# EAGLE design WiFi_Board_R1_1_0 (EAGLE 6.6.0)
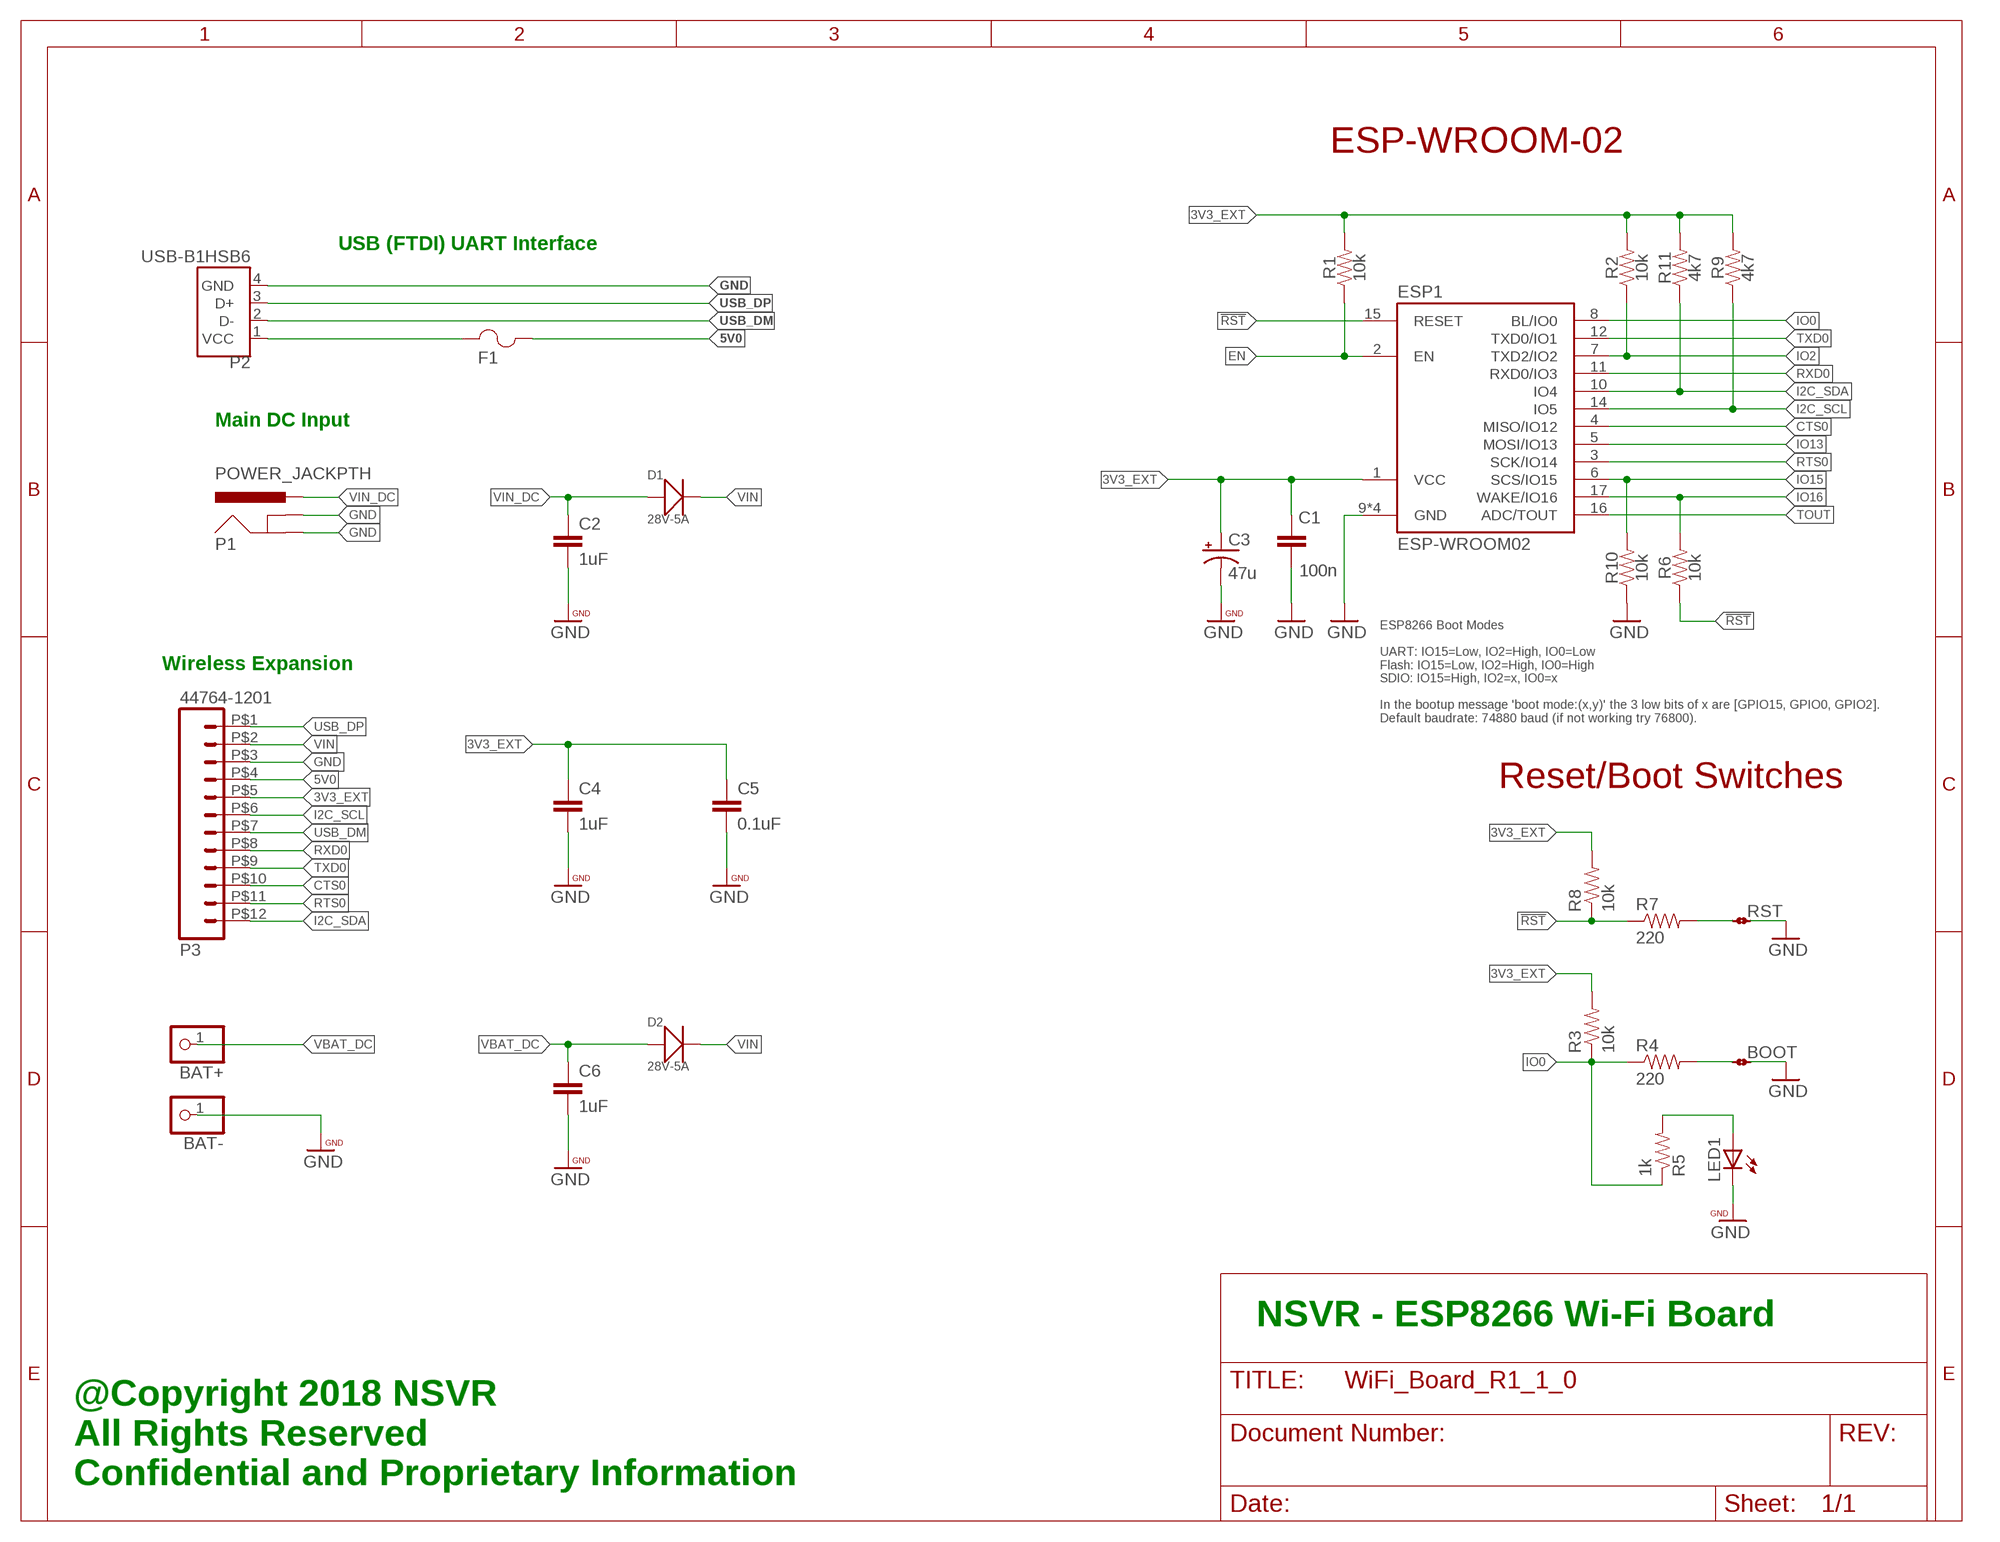
[diagram p0: schematic, sheet 1]

## Parts
BAT+  WPAD-1-PTH  [WPAD-1-PTH-2.54]
BAT-  WPAD-1-PTH  [WPAD-1-PTH-2.54]
BOOT  JMP-2-NO-PTH  [JMP-2-NO-PTH-2.54]
C1  100n  CAP0402-CAP  [0402-CAP]
C2  1uF  CAP0402-CAP  [0402-CAP]
C3  47u  CAP_POLD  [PANASONIC_D]
C4  1uF  CAP0402-CAP  [0402-CAP]
C5  0.1uF  CAP0402-CAP  [0402-CAP]
C6  1uF  CAP0402-CAP  [0402-CAP]
D1  28V-5A  SMD-DIODE-SCHOTTKY-28V-5A(DO-214AA)  [DO-214AA]
D2  28V-5A  SMD-DIODE-SCHOTTKY-28V-5A(DO-214AA)  [DO-214AA]
ESP1  ESP-WROOM02  [ESP-WROOM02]
F1  1206L050YR  [1206LSERIES]
LED1  LEDCHIP-LED0603  [CHIP-LED0603]
P1  POWER_JACKPTH  [POWER_JACK_PTH]
P2  USB-B1HSB6  [OST_USB-B1HSB6]
P3  44764-1201  [44764-1201]
R1  10k  RESISTOR0402-TYP  [EIA-0402]
R2  10k  RESISTOR0402-TYP  [EIA-0402]
R3  10k  RESISTOR0402-TYP  [EIA-0402]
R4  220  RESISTOR0402-TYP  [EIA-0402]
R5  1k  RESISTOR0402-TYP  [EIA-0402]
R6  10k  RESISTOR0402-TYP  [EIA-0402]
R7  220  RESISTOR0402-TYP  [EIA-0402]
R8  10k  RESISTOR0402-TYP  [EIA-0402]
R9  4k7  RESISTOR0402-TYP  [EIA-0402]
R10  10k  RESISTOR0402-TYP  [EIA-0402]
R11  4k7  RESISTOR0402-TYP  [EIA-0402]
RST  JMP-2-NO-PTH  [JMP-2-NO-PTH-2.54]

## Nets
3V3_EXT: C1.2 C3.+ C4.1 C5.1 ESP1.1(VCC) P3.P$5 R1.2 R2.2 R3.2 R8.2 R9.2 R11.2
5V0: F1.2 P3.P$4
!RST: ESP1.15(RESET) R6.1 R7.1 R8.1
CTS0: ESP1.4(MISO/IO12) P3.P$10
EN: ESP1.2(EN) R1.1
GND: BAT-.1 BOOT.2 C1.1 C2.2 C3.- C4.2 C5.2 C6.2 ESP1.9(GND) ESP1.13(GND) ESP1.18(GND) ESP1.TP(GND) LED1.C P1.GND P1.GNDBREAK P2.4(GND) P3.P$3 R10.1 RST.2
I2C_SCL: ESP1.14(IO5) P3.P$6 R9.1
I2C_SDA: ESP1.10(IO4) P3.P$12 R11.1
IO0: ESP1.8(BL/IO0) R3.1 R4.1 R5.1
IO2: ESP1.7(TXD2/IO2) R2.1
IO13: ESP1.5(MOSI/IO13)
IO15: ESP1.6(SCS/IO15) R10.2
IO16: ESP1.17(WAKE/IO16) R6.2
LED1: LED1.A R5.2
N$1: R7.2 RST.1
N$2: BOOT.1 R4.2
RTS0: ESP1.3(SCK/IO14) P3.P$11
RXD0: ESP1.11(RXD0/IO3) P3.P$8
TOUT: ESP1.16(ADC/TOUT)
TXD0: ESP1.12(TXD0/IO1) P3.P$9
USB_DM: P2.2(D-) P3.P$7
USB_DP: P2.3(D+) P3.P$1
VBAT_DC: BAT+.1 C6.1 D2.+
VBUS_IN: F1.1 P2.1(VCC)
VIN: D1.- D2.- P3.P$2
VIN_DC: C2.1 D1.+ P1.PWR

## Notes on the sheet
- ESP-WROOM-02
- USB (FTDI) UART Interface
- Main DC Input
- ESP8266 Boot Modes
  
  UART: IO15=Low, IO2=High, IO0=Low
  Flash: IO15=Low, IO2=High, IO0=High
  SDIO: IO15=High, IO2=x, IO0=x
  
  In the bootup message 'boot mode:(x,y)' the 3 low bits of x are [GPIO15, GPIO0, GPIO2].
  Default baudrate: 74880 baud (if not working try 76800).
- Wireless Expansion
- Reset/Boot Switches
- NSVR - ESP8266 Wi-Fi Board
- @Copyright 2018 NSVR
  All Rights Reserved
  Confidential and Proprietary Information

## Library data of the parts
BAT+ BAT- = PatternAgents-ProtoPads:WPAD-1: Wire Pad - Single Good for scope lead clips, test jumpers, probe points, etc. PatternAgents ProtoPads Library Schematic and PCB layout libraries for design patterns by PatternAgents. For the CADSoft Eagle CAD program : http://www.cadsoftusa.com/download-eagle/ Source LBR : http://www.patternagents.com Github : https://github.com/PatternAgents License : http://creativecommons.org/licenses/by-sa/4.0/ (Creative Commons 4.0) THIS SOFTWARE IS PROVIDED BY THE CONTRIBUTORS "AS IS" AND WITHOUT ANY EXPRESS OR IMPLIED WARRANTIES, INCLUDING, BUT NOT LIMITED TO, THE IMPLIED WARRANTIES OF MERCHANTABILITY AND FITNESS FOR A PARTICULAR PURPOSE ARE DISCLAIMED. IN NO EVENT SHALL THE COPYRIGHT OWNER OR CONTRIBUTORS BE LIABLE FOR ANY DIRECT, INDIRECT, INCIDENTAL, SPECIAL, EXEMPLARY, OR CONSEQUENTIAL DAMAGES (INCLUDING, BUT NOT LIMITED TO, PROCUREMENT OF SUBSTITUTE GOODS OR SERVICES; LOSS OF USE, DATA, OR PROFITS; OR BUSINESS INTERRUPTION) HOWEVER CAUSED AND ON ANY THEORY OF LIABILITY, WHETHER IN CONTRACT, STRICT LIABILITY, OR TORT (INCLUDING NEGLIGENCE OR OTHERWISE) ARISING IN ANY WAY OUT OF THE USE OF THIS SOFTWARE, EVEN IF ADVISED OF THE POSSIBILITY OF SUCH DAMAGE.; BOM: EXCLUDE
BOOT RST = PatternAgents-ProtoPads:JMP-2-NO: Two Terminal Jumper - Normally Open Positions 1 and 2 are normally NOT connected. PatternAgents ProtoPads Library Schematic and PCB layout libraries for design patterns by PatternAgents. For the CADSoft Eagle CAD program : http://www.cadsoftusa.com/download-eagle/ Source LBR : http://www.patternagents.com Github : https://github.com/PatternAgents License : http://creativecommons.org/licenses/by-sa/4.0/ (Creative Commons 4.0) THIS SOFTWARE IS PROVIDED BY THE CONTRIBUTORS "AS IS" AND WITHOUT ANY EXPRESS OR IMPLIED WARRANTIES, INCLUDING, BUT NOT LIMITED TO, THE IMPLIED WARRANTIES OF MERCHANTABILITY AND FITNESS FOR A PARTICULAR PURPOSE ARE DISCLAIMED. IN NO EVENT SHALL THE COPYRIGHT OWNER OR CONTRIBUTORS BE LIABLE FOR ANY DIRECT, INDIRECT, INCIDENTAL, SPECIAL, EXEMPLARY, OR CONSEQUENTIAL DAMAGES (INCLUDING, BUT NOT LIMITED TO, PROCUREMENT OF SUBSTITUTE GOODS OR SERVICES; LOSS OF USE, DATA, OR PROFITS; OR BUSINESS INTERRUPTION) HOWEVER CAUSED AND ON ANY THEORY OF LIABILITY, WHETHER IN CONTRACT, STRICT LIABILITY, OR TORT (INCLUDING NEGLIGENCE OR OTHERWISE) ARISING IN ANY WAY OUT OF THE USE OF THIS SOFTWARE, EVEN IF ADVISED OF THE POSSIBILITY OF SUCH DAMAGE.; BOM: EXCLUDE
C1 C2 C4-C6 = PatternAgents-ProtoPads:CAP: Capacitor Standard 0603 ceramic capacitor, and 0.1" leaded capacitor.
C3 = SparkFun-Capacitors:CAP_POL: Capacitor Polarized These are standard SMD and PTH capacitors. Normally 10uF, 47uF, and 100uF in electrolytic and tantalum varieties. Always verify the external diameter of the through hole cap, it varies with capacity, voltage, and manufacturer. The EIA devices should be standard.
D1 D2 = Seeed-Diode-2016:SMD-DIODE-SCHOTTKY-28V-5A(DO-214AA): 304020021; MPN: SS54B
ESP1 = we-chip:ESP-WROOM02: Espressif ESP-WROOM-02 and AI-Thinker ESP-12 ESP8266 WiFi/WLAN Module
F1 = 1206L050:1206L050YR; COPYRIGHT: Copyright C 2015 Accelerated Designs. All rights reserved; MANUFACTURER_PART_NUMBER: 1206L050YR; VENDOR: Littelfuse Inc
LED1 = led:LED: LED OSRAM: - CHIPLED LG R971, LG N971, LY N971, LG Q971, LY Q971, LO R971, LY R971 LH N974, LH R974 LS Q976, LO Q976, LY Q976 LO Q996 - Hyper CHIPLED LW Q18S LB Q993, LB Q99A, LB R99A - SideLED LS A670, LO A670, LY A670, LG A670, LP A670 LB A673, LV A673, LT A673, LW A673 LH A674 LY A675 LS A676, LA A676, LO A676, LY A676, LW A676 LS A679, LY A679, LG A679 - Hyper Micro SIDELED® LS Y876, LA Y876, LO Y876, LY Y876 LT Y87S - SmartLED LW L88C, LW L88S LB L89C, LB L89S, LG L890 LS L89K, LO L89K, LY L89K LS L896, LA L896, LO L896, LY L896 - TOPLED LS T670, LO T670, LY T670, LG T670, LP T670 LSG T670, LSP T670, LSY T670, LOP T670, LYG T670 LG T671, LOG T671, LSG T671 LB T673, LV T673, LT T673, LW T673 LH T674 LS T676, LA T676, LO T676, LY T676, LB T676, LH T676, LSB T676, LW T676 LB T67C, LV T67C, LT T67C, LS T67K, LO T67K, LY T67K, LW E67C LS E67B, LA E67B, LO E67B, LY E67B, LB E67C, LV E67C, LT E67C LW T67C LS T679, LY T679, LG T679 LS T770, LO T770, LY T770, LG T770, LP T770 LB T773, LV T773, LT T773, LW T773 LH T774 LS E675, LA E675, LY E675, LS T675 LS T776, LA T776, LO T776, LY T776, LB T776 LHGB T686 LT T68C, LB T68C - Hyper Mini TOPLED® LB M676 - Mini TOPLED Santana® LG M470 LS M47K, LO M47K, LY M47K Source: http://www.osram.convergy.de LUXEON: - LUMILED® LXK2-PW12-R00, LXK2-PW12-S00, LXK2-PW14-U00, LXK2-PW14-V00 LXK2-PM12-R00, LXK2-PM12-S00, LXK2-PM14-U00 LXK2-PE12-Q00, LXK2-PE12-R00, LXK2-PE12-S00, LXK2-PE14-T00, LXK2-PE14-U00 LXK2-PB12-K00, LXK2-PB12-L00, LXK2-PB12-M00, LXK2-PB14-N00, LXK2-PB14-P00, LXK2-PB14-Q00 LXK2-PR12-L00, LXK2-PR12-M00, LXK2-PR14-Q00, LXK2-PR14-R00 LXK2-PD12-Q00, LXK2-PD12-R00, LXK2-PD12-S00 LXK2-PH12-R00, LXK2-PH12-S00 LXK2-PL12-P00, LXK2-PL12-Q00, LXK2-PL12-R00 Source: www.luxeon.com KINGBRIGHT: KA-3528ASYC Source: www.kingbright.com
P1 = SparkFun-Connectors:POWER_JACK: Power Jack This is the standard 5.5mm barrel jack for power. The PTH is the most common, proven, reliable, footprint. The Slot footprint only works if the mill layer is transmitted to the PCB fab house so be warned. Mating wall wart : TOL-00298 (and others); PROD_ID: CONN-08197
P2 = USB-B1HSB6:USB-B1HSB6: Conn Usb Type b r/a Black; AVAILABILITY: Warning; DESCRIPTION: Conn Usb Type b r/a Black; MF: On Shore Technology; MP: USB-B1HSB6; PACKAGE: None; PRICE: 0.42 USD
P3 = nsvr:44764-1201
R1-R11 = PatternAgents-ProtoPads:RESISTOR: Resistor Basic schematic elements and footprints for 0603, 1206, and PTH resistors.

## Board
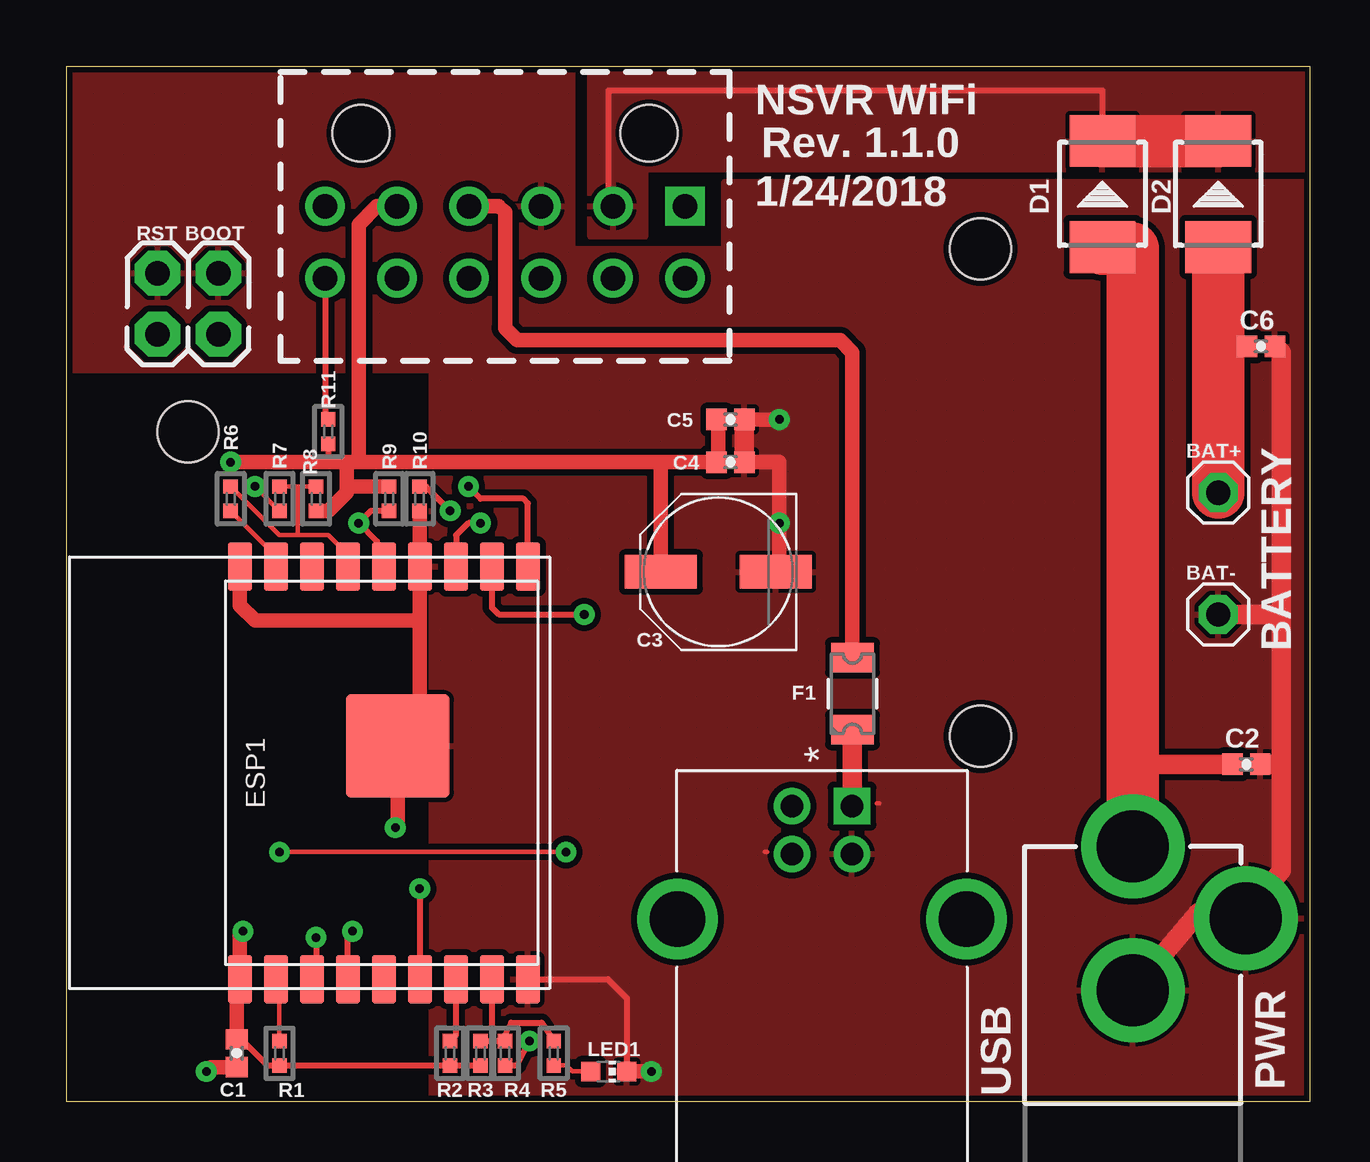
[diagram p1: board, top side]
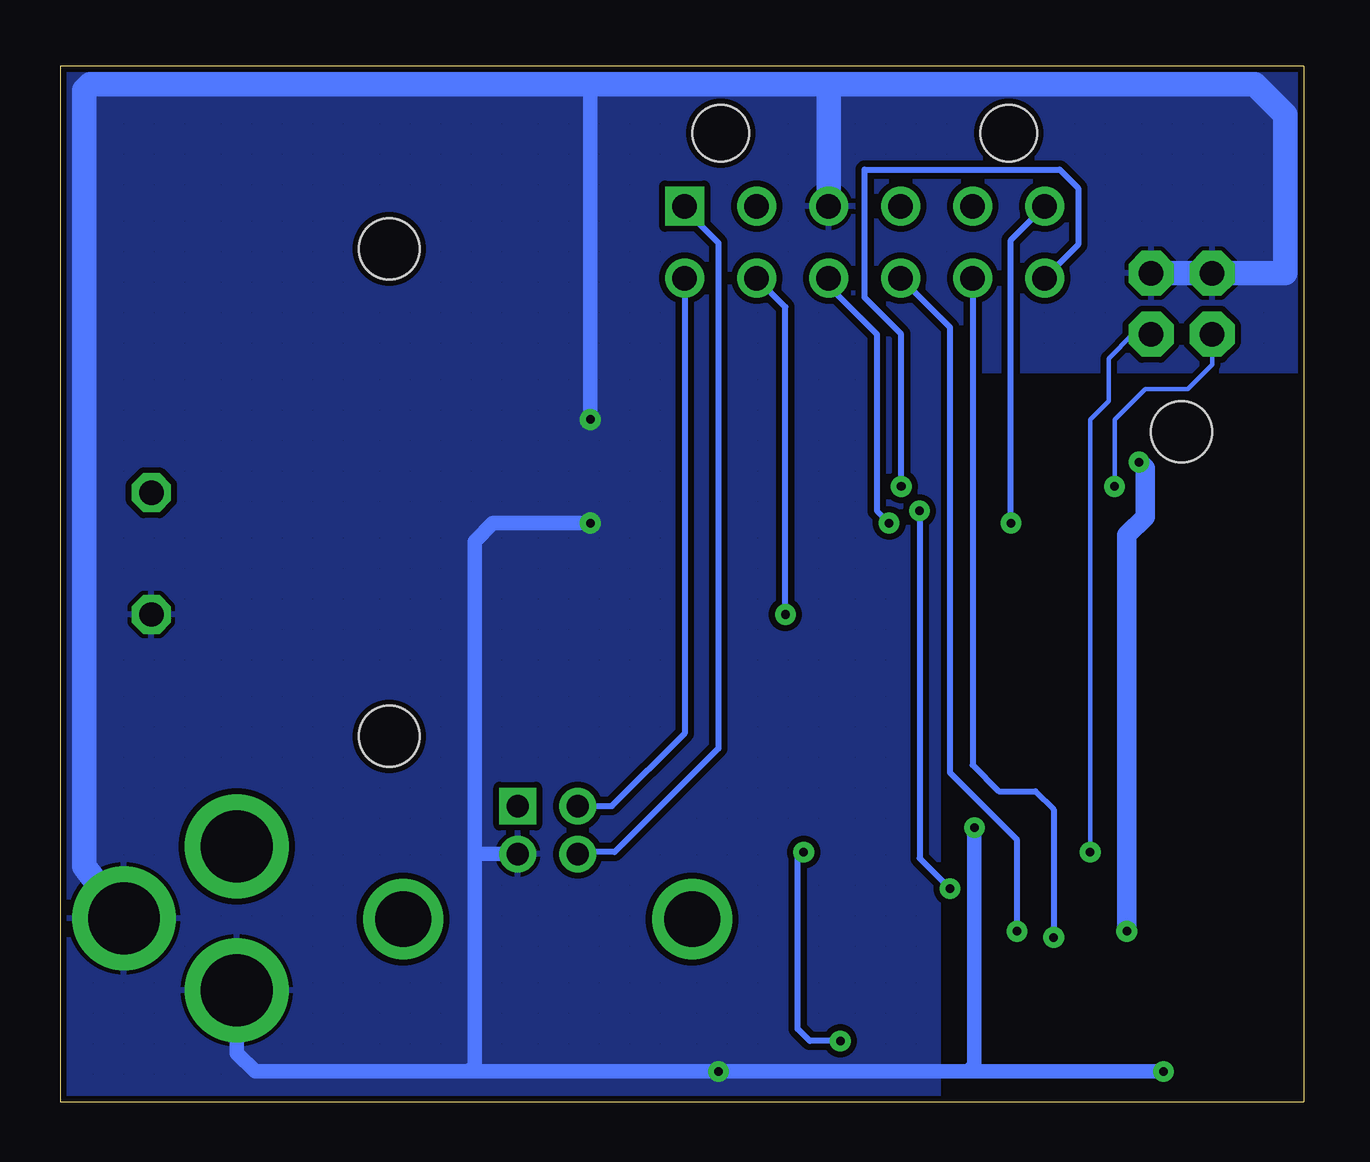
[diagram p2: board, bottom side, seen from below]

Size 51.82 x 43.18 mm. Coordinates in mm from the lower left corner, seen from the top.
Outline: 0,43.18 0,0 51.82,0 51.82,43.18 0,43.18
Copper layers (1*16): Top 0.035mm / dielectric 1.5mm / Bottom 0.035mm
Design rules "PatternAgents_7mil": minimum track width 7mil, minimum drill 14mil, track to track 7mil, track to pad 7mil, pad to pad 7mil, via to via 7mil, smd to smd 7mil, copper to edge 7mil, drill to drill 7mil, minimum pad ring 12mil, minimum via ring 10mil, stop-mask expansion 4mil, vias tented up to drill 25mil, thermal gap 7mil
Holes 2.54 mm at 38.1,35.56 5.08,27.94 38.1,15.24

### Footprints (pad centres in the part's own frame; a part is rotated, then mirrored left to right if it is on the bottom)
WPAD-1-PTH-2.54 = drill 1.016 octagon: 1 0,0
JMP-2-NO-PTH-2.54 = drill 1.016 pad 1.88 octagon: 1 0,0; 2 2.54,0
0402-CAP = smd 0.85 x 0.9: 1 -0.58,0; 2 0.58,0
PANASONIC_D = smd 3 x 1.4: + 2.4,0; - -2.4,0
DO-214AA = smd 2.159 x 2.743: + -2.21,0; - 2.21,0
ESP-WROOM02 = smd 2 x 1: 1 -8.6,1.9; 2 -8.6,0.4; 3 -8.6,-1.1; 4 -8.6,-2.6; 5 -8.6,-4.1; 6 -8.6,-5.6; 7 -8.6,-7.1; 8 -8.6,-8.6; 9 -8.6,-10.1; 10 8.6,-10.1; 11 8.6,-8.6; 12 8.6,-7.1; 13 8.6,-5.6; 14 8.6,-4.1; 15 8.6,-2.6; 16 8.6,-1.1; 17 8.6,0.4; 18 8.6,1.9 | smd 4.3 x 4.3: TP 1.12,-4.68
1206LSERIES = smd 1.219 x 1.778: 1 -1.499,0; 2 1.499,0
CHIP-LED0603 = smd 0.8 x 0.8: A 0,-0.75; C 0,0.75
POWER_JACK_PTH = drill 2.997 pad 4.318: GND 0,7.7; GNDBREAK 4.7,10.7; PWR 0,13.7
OST_USB-B1HSB6 = drill 0.92 square: 1 1.25,4.71 | drill 0.92: 2 -1.25,4.71; 3 -1.25,2.71; 4 1.25,2.71 | drill 2.33: P1 -6.02,0; P2 6.02,0
44764-1201 = drill 1.02 square: P$1 -7.5,0 | drill 1.02: P$2 -4.5,0; P$3 -1.5,0; P$4 1.5,0; P$5 4.5,0; P$6 7.5,0; P$7 -7.5,3; P$8 -4.5,3; P$9 -1.5,3; P$10 1.5,3; P$11 4.5,3; P$12 7.5,3 | hole 2.36: -6,-3.05; 6,-3.05
EIA-0402 = smd 0.6 x 0.6: 1 -0.508,0; 2 0.508,0

### Placement (x,y rotation side)
BAT+  48.01,25.4 0 top
BAT-  48.01,20.32 0 top
BOOT  6.35,32 90 top
C1  7.11,2.03 90 top
C2  49.17,14.07 0 top
C3  27.18,22.1 180 top
C4  27.69,26.67 0 top
C5  27.69,28.45 0 top
C6  49.78,31.5 0 top
D1  43.18,37.85 90 top
D2  48.01,37.85 90 top
ESP1  9.14,13.72 90 top
F1  32.77,17.02 90 top
LED1  22.61,1.27 270 top
P1  44.45,-3.05 0 top
P2  31.5,7.62 0 top
P3  18.29,37.34 180 top
R1  8.89,2.03 270 top
R2  16,2.03 270 top
R3  17.27,2.03 270 top
R4  18.29,2.03 270 top
R5  20.32,2.03 270 top
R6  6.86,25.15 270 top
R7  8.89,25.15 270 top
R8  10.41,25.15 270 top
R9  13.46,25.15 90 top
R10  14.73,25.15 90 top
R11  10.92,27.94 270 top
RST  3.81,32 90 top

### Tracks (layer width: path | path; a pad name or v marks a point on that pad's centre or on a via)
3V3_EXT  (via drill 0.36)
  Top 0.254: C1.2 7.29,2.61 8.38,1.52 R1.2 R2.2 R3.2 | R11.2 10.92,26.67
  Top 0.61: C1.2 7.11,4.98 ESP1.1 7.24,6.99 v7.37,7.11 | R8.2 10.92,24.64 11.68,25.4 11.68,25.65 | 11.68,25.65 11.68,26.67 | 11.68,26.67 12.19,26.67 | 12.19,26.67 24.89,26.67 | 24.89,26.67 C4.1 27.18,26.74 27.18,28.45 C5.1 | C3.+ 24.78,26.56 24.89,26.67 | R9.2 11.68,25.65 | P3.P$5 12.95,37.34 12.19,36.58 12.19,26.67 | v6.86,26.67 10.92,26.67 11.68,26.67
  Bottom 0.813: v7.37,7.11 7.37,23.62 6.6,24.38 6.6,26.42 v6.86,26.67
5V0
  Top 0.61: P3.P$4 18.03,37.34 18.29,37.08 18.29,32.26 18.8,31.75 32.26,31.75 32.77,31.24 F1.2
!RST
  Top 0.178: R8.1 9.65,25.65 | 9.65,25.65 R7.1 | 9.65,23.62 10.92,23.62 11.68,22.86 11.68,22.35 ESP1.15 | 9.65,23.62 8.89,23.62 R6.1 | 9.65,23.62 9.65,25.65
CTS0  (via drill 0.36)
  Top 0.254: ESP1.4 11.74,6.92 v11.94,7.11
  Bottom 0.254: v11.94,7.11 11.94,10.92 14.73,13.72 14.73,32.28 P3.P$10
EN
  Top 0.178: R1.1 8.89,5.08 ESP1.2
GND  (via drill 0.36)
  Top 0.178: 14.73,22.35 ESP1.13 | 29.21,10.41 29.1,10.41 | 33.78,12.45 33.89,12.45 | 2.54,31.5 2.49,31.5
  Top 0.254: ESP1.9 22.57,5.12 23.37,4.32 23.37,1.28 LED1.C
  Top 0.406: 14.73,15.74 ESP1.TP
  Top 0.61: 14.73,22.35 14.73,20.07 | 14.73,20.07 14.73,15.74 | C1.1 6.02,1.45 v5.84,1.27 | LED1.C v24.38,1.27 | ESP1.TP 13.82,11.54 v13.72,11.43 | C5.2 v29.72,28.45 | C4.2 29.72,26.67 v29.72,24.13 29.72,22.24 C3.- | ESP1.18 7.24,20.7 7.87,20.07 14.73,20.07 | R10.1 ESP1.13
  Top 0.813: 50.04,14.07 C2.2 50.53,14.07 50.63,13.97 | 50.63,20.32 50.63,13.97 | 50.63,13.97 50.63,9.64 P1.GNDBREAK 47.2,7.91 P1.GND | BAT-.1 48.51,20.32 50.63,20.32 | 50.63,20.32 50.63,31.23 C6.2 | C4.2 C5.2
  Bottom 0.61: v5.84,1.27 13.97,1.27 | 13.97,1.27 v24.38,1.27 34.8,1.27 | 34.8,1.27 43.69,1.27 44.45,2.03 P1.GND | v13.72,11.43 13.72,1.52 13.97,1.27 | v29.72,28.45 29.72,42.42 | v29.72,24.13 33.78,24.13 34.54,23.37 34.54,10.16 | 34.54,10.16 34.54,1.52 34.8,1.27 | P2.4 34.37,10.33 34.54,10.16
  Bottom 1.016: 19.81,42.42 2.03,42.42 0.76,41.15 0.76,34.54 RST.2 BOOT.2 | 19.81,42.42 29.72,42.42 50.55,42.42 50.8,42.16 50.8,9.81 P1.GNDBREAK | P3.P$3 19.79,42.39 19.81,42.42
  pour Bottom (isolate 0.254, hatched): 15.24,0 51.82,0 51.82,43.18 0,43.18 0,30.48 15.24,30.48
  pour Top (isolate 0.254, rank 2, hatched): 15.24,0 15.24,30.48 0,30.48 0,43.18 21.08,43.18 21.08,35.56 27.43,35.56 27.43,38.35 51.82,38.35 51.82,0
I2C_SCL  (via drill 0.36)
  Top 0.254: ESP1.14 12.95,22.61 12.95,23.37 v12.19,24.13 12.7,24.64 R9.1
  Bottom 0.254: v12.19,24.13 12.19,35.93 P3.P$6
I2C_SDA  (via drill 0.36)
  Top 0.254: ESP1.10 19.24,24.95 19.05,25.15 17.27,25.15 v16.76,25.65 | P3.P$12 10.79,28.58 R11.1
  Bottom 0.254: v16.76,25.65 16.76,32 18.29,33.53 18.29,38.86 10.16,38.86 9.4,38.1 9.4,35.73 P3.P$12
IO0
  Top 0.254: R3.1 17.78,2.54 | 17.78,2.54 R4.1 18.29,2.79 18.54,3.3 19.81,3.3 R5.1 | ESP1.8 17.74,2.58 17.78,2.54
IO2
  Top 0.254: ESP1.7 16.24,2.78 R2.1
IO15  (via drill 0.36)
  Top 0.254: R10.2 14.99,25.65 v16,24.64 | v14.73,8.89 ESP1.6
  Bottom 0.254: v16,24.64 16,10.16 v14.73,8.89
IO16
  Top 0.178: R6.2 8.64,22.86 8.64,22.35 ESP1.17
LED1
  Top 0.178: R5.2 20.83,1.52 21.08,1.27 LED1.A
N$1  (via drill 0.36)
  Top 0.178: R7.2 v7.87,25.65
  Bottom 0.178: v7.87,25.65 7.87,28.45 6.6,29.72 4.83,29.72 3.81,30.73 RST.1
N$2  (via drill 0.36)
  Top 0.178: v8.89,10.41 v20.83,10.41
  Top 0.254: R4.2 18.8,1.52 v19.3,2.54
  Bottom 0.178: BOOT.1 7.11,32 8.13,30.99 8.13,29.21 8.89,28.45 v8.89,10.41
  Bottom 0.254: v19.3,2.54 20.57,2.54 21.08,3.05 21.08,10.16 v20.83,10.41
RTS0  (via drill 0.36)
  Top 0.254: v10.41,6.86 10.41,5.29 ESP1.3
  Bottom 0.254: P3.P$11 13.79,14.04 12.7,12.95 11.18,12.95 10.41,12.19 v10.41,6.86
RXD0  (via drill 0.36)
  Top 0.254: ESP1.11 17.74,20.61 18.03,20.32 v21.59,20.32
  Bottom 0.254: v21.59,20.32 21.59,33.14 P3.P$8
TXD0  (via drill 0.36)
  Top 0.254: v17.27,24.13 16.76,24.13 16.26,23.62 16.26,22.33 ESP1.12
  Bottom 0.254: P3.P$9 19.79,34.01 17.78,32 17.78,24.64 v17.27,24.13
USB_DM
  Bottom 0.254: P2.2 28.82,12.33 25.79,15.36 P3.P$7
USB_DP
  Bottom 0.254: P3.P$1 25.79,37.22 24.38,35.81 24.38,14.73 28.7,10.41 30.16,10.41 P2.3
VBAT_DC
  Top 0.813: C6.1 48.01,31.5
  Top 2.184: BAT+.1 48.01,31.5 D2.+
VBUS_IN
  Top 0.813: F1.1 32.77,12.35 P2.1
VIN
  Top 0.254: P3.P$2 22.61,37.34 22.61,42.16 43.18,42.16 D1.-
  Top 2.184: D2.- D1.-
  pour Top (isolate 0.203, rank 2, hatched): 24.13,36.07 21.84,36.07 21.84,42.93 51.56,42.93 51.56,38.86 24.13,38.86
VIN_DC
  Top 0.813: C2.1 44.45,14.07 44.45,14.22
  Top 2.184: P1.PWR 44.45,14.22 44.45,35.56 43.18,35.56 D1.+

### Text on the board
tPlace: NSVR WiFi | Rev. 1.1.0 | 1/24/2018 | BATTERY | F1 | PWR | USB